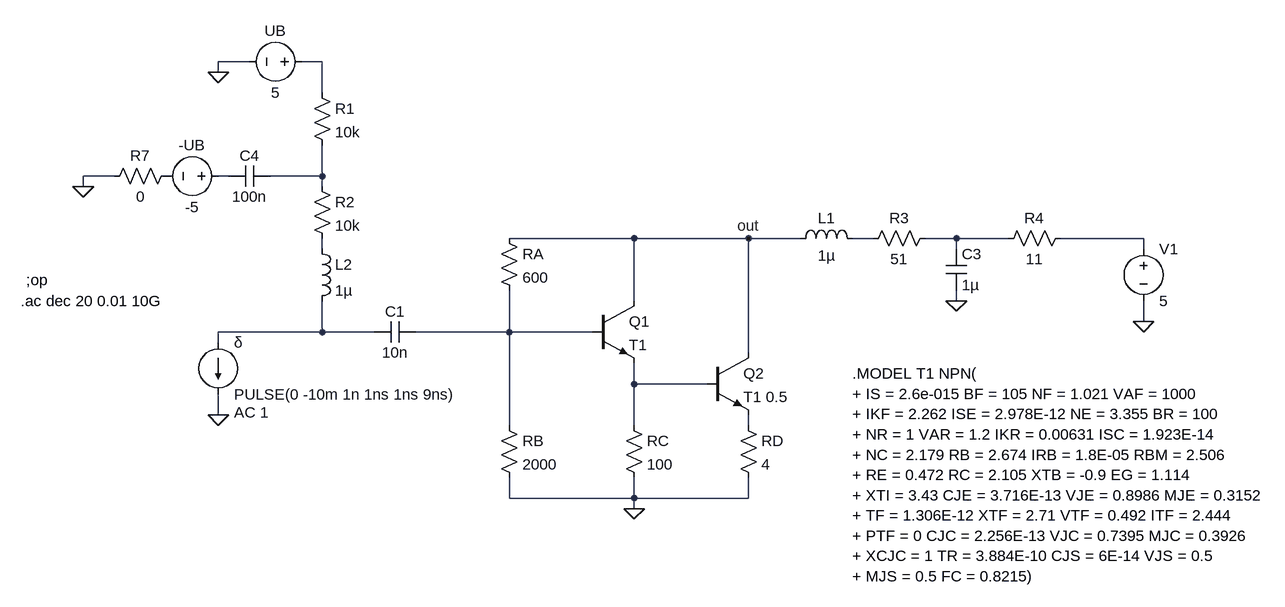
[diagram p0: schematic prova_simulazione_preamp_con_bjt.asc]
prova_simulazione_preamp_con_bjt.asc, the LTspice schematic file:
Version 4
SHEET 1 1568 680
WIRE -160 -320 -208 -320
WIRE -48 -320 -80 -320
WIRE -208 -304 -208 -320
WIRE -48 -272 -48 -320
WIRE -368 -144 -416 -144
WIRE -192 -144 -208 -144
WIRE -48 -144 -48 -192
WIRE -48 -144 -128 -144
WIRE -416 -128 -416 -144
WIRE -48 -128 -48 -144
WIRE 432 -48 240 -48
WIRE 608 -48 432 -48
WIRE 688 -48 608 -48
WIRE 800 -48 768 -48
WIRE 928 -48 880 -48
WIRE 1008 -48 928 -48
WIRE 1216 -48 1088 -48
WIRE -48 -32 -48 -48
WIRE 928 -32 928 -48
WIRE 1216 -32 1216 -48
WIRE 432 48 432 -48
WIRE 928 48 928 32
WIRE 1216 80 1216 48
WIRE -48 96 -48 48
WIRE -48 96 -208 96
WIRE 32 96 -48 96
WIRE 240 96 240 32
WIRE 240 96 96 96
WIRE 368 96 240 96
WIRE -208 112 -208 96
WIRE 608 128 608 -48
WIRE 432 176 432 144
WIRE 544 176 432 176
WIRE -208 224 -208 192
WIRE 240 240 240 96
WIRE 432 240 432 176
WIRE 608 240 608 224
WIRE 240 352 240 320
WIRE 432 352 432 320
WIRE 432 352 240 352
WIRE 608 352 608 320
WIRE 608 352 432 352
WIRE 432 368 432 352
FLAG 432 368 0
FLAG 928 48 0
FLAG 1216 80 0
FLAG -208 -304 0
FLAG -208 224 0
FLAG -416 -128 0
FLAG 608 -48 out
SYMBOL cap 96 80 R90
WINDOW 0 0 32 VBottom 2
WINDOW 3 32 32 VTop 2
SYMATTR InstName C1
SYMATTR Value 10n
SYMBOL ind 672 -32 R270
WINDOW 0 32 56 VTop 2
WINDOW 3 5 56 VBottom 2
SYMATTR InstName L1
SYMATTR Value 1µ
SYMBOL res 896 -64 R90
WINDOW 0 0 56 VBottom 2
WINDOW 3 32 56 VTop 2
SYMATTR InstName R3
SYMATTR Value 51
SYMBOL cap 912 -32 R0
SYMATTR InstName C3
SYMATTR Value 1µ
SYMBOL res 1104 -64 R90
WINDOW 0 0 56 VBottom 2
WINDOW 3 32 56 VTop 2
SYMATTR InstName R4
SYMATTR Value 11
SYMBOL voltage 1216 -48 R0
WINDOW 123 0 0 Left 0
WINDOW 39 0 0 Left 0
SYMATTR InstName V1
SYMATTR Value 5
SYMBOL res -64 -288 R0
SYMATTR InstName R1
SYMATTR Value 10k
SYMBOL res -64 -144 R0
SYMATTR InstName R2
SYMATTR Value 10k
SYMBOL cap -128 -160 R90
WINDOW 0 0 32 VBottom 2
WINDOW 3 32 32 VTop 2
SYMATTR InstName C4
SYMATTR Value 100n
SYMBOL voltage -64 -320 R90
WINDOW 0 -32 56 VBottom 2
WINDOW 3 32 56 VTop 2
SYMATTR InstName UB
SYMATTR Value 5
SYMBOL voltage -192 -144 R90
WINDOW 0 -32 56 VBottom 2
WINDOW 3 32 56 VTop 2
SYMATTR InstName -UB
SYMATTR Value -5
SYMBOL current -208 112 R0
WINDOW 123 24 108 Left 2
WINDOW 39 0 0 Left 0
SYMATTR Value2 AC 1
SYMATTR InstName δ
SYMATTR Value PULSE(0 -10m 1n 1ns 1ns 9ns)
SYMBOL ind -64 -48 R0
SYMATTR InstName L2
SYMATTR Value 1µ
SYMBOL res -272 -160 R90
WINDOW 0 0 56 VBottom 2
WINDOW 3 32 56 VTop 2
SYMATTR InstName R7
SYMATTR Value 0
SYMBOL res 224 -64 R0
SYMATTR InstName RA
SYMATTR Value 600
SYMBOL res 224 224 R0
SYMATTR InstName RB
SYMATTR Value 2000
SYMBOL res 592 224 R0
SYMATTR InstName RD
SYMATTR Value 4
SYMBOL res 416 224 R0
SYMATTR InstName RC
SYMATTR Value 100
SYMBOL npn 368 48 R0
SYMATTR InstName Q1
SYMATTR Value T1
SYMBOL npn 544 128 R0
SYMATTR InstName Q2
SYMATTR Value T1 0.5
TEXT -512 48 Left 2 !.ac dec 20 0.01 10G
TEXT -504 16 Left 2 !;op
TEXT 768 160 Left 2 !.MODEL T1 NPN(\n+ IS = 2.6e-015 BF = 105 NF = 1.021 VAF = 1000\n+ IKF = 2.262 ISE = 2.978E-12 NE = 3.355 BR = 100\n+ NR = 1 VAR = 1.2 IKR = 0.00631 ISC = 1.923E-14\n+ NC = 2.179 RB = 2.674 IRB = 1.8E-05 RBM = 2.506\n+ RE = 0.472 RC = 2.105 XTB = -0.9 EG = 1.114\n+ XTI = 3.43 CJE = 3.716E-13 VJE = 0.8986 MJE = 0.3152\n+ TF = 1.306E-12 XTF = 2.71 VTF = 0.492 ITF = 2.444\n+ PTF = 0 CJC = 2.256E-13 VJC = 0.7395 MJC = 0.3926\n+ XCJC = 1 TR = 3.884E-10 CJS = 6E-14 VJS = 0.5\n+ MJS = 0.5 FC = 0.8215)

The netlist it stands for:
* prova_simulazione_preamp_con_bjt.asc
C1 N009 N008 10n
L1 out N004 1µ
R3 N005 N004 51
C3 N005 0 1µ
R4 N006 N005 11
V1 N006 0 5
R1 N001 N003 10k
R2 N003 N007 10k
C4 N003 N002 100n
V§UB N001 0 5
V§-UB N002 P001 -5
I§δ N008 0 PULSE(0 -10m 1n 1ns 1ns 9ns) AC 1
L2 N007 N008 1µ
R7 P001 0 0
RA out N009 600
RB N009 0 2000
RD N011 0 4
RC N010 0 100
Q1 out N009 N010 0 T1
Q2 out N010 N011 0 T1 0.5
.model NPN NPN
.model PNP PNP
.lib standard.bjt
.ac dec 20 0.01 10G
;op
.MODEL T1 NPN(
+ IS = 2.6e-015 BF = 105 NF = 1.021 VAF = 1000
+ IKF = 2.262 ISE = 2.978E-12 NE = 3.355 BR = 100
+ NR = 1 VAR = 1.2 IKR = 0.00631 ISC = 1.923E-14
+ NC = 2.179 RB = 2.674 IRB = 1.8E-05 RBM = 2.506
+ RE = 0.472 RC = 2.105 XTB = -0.9 EG = 1.114
+ XTI = 3.43 CJE = 3.716E-13 VJE = 0.8986 MJE = 0.3152
+ TF = 1.306E-12 XTF = 2.71 VTF = 0.492 ITF = 2.444
+ PTF = 0 CJC = 2.256E-13 VJC = 0.7395 MJC = 0.3926
+ XCJC = 1 TR = 3.884E-10 CJS = 6E-14 VJS = 0.5
+ MJS = 0.5 FC = 0.8215)
.backanno
.end